# Altium schematic sheet NL_Sheet1.SchDoc
size A3
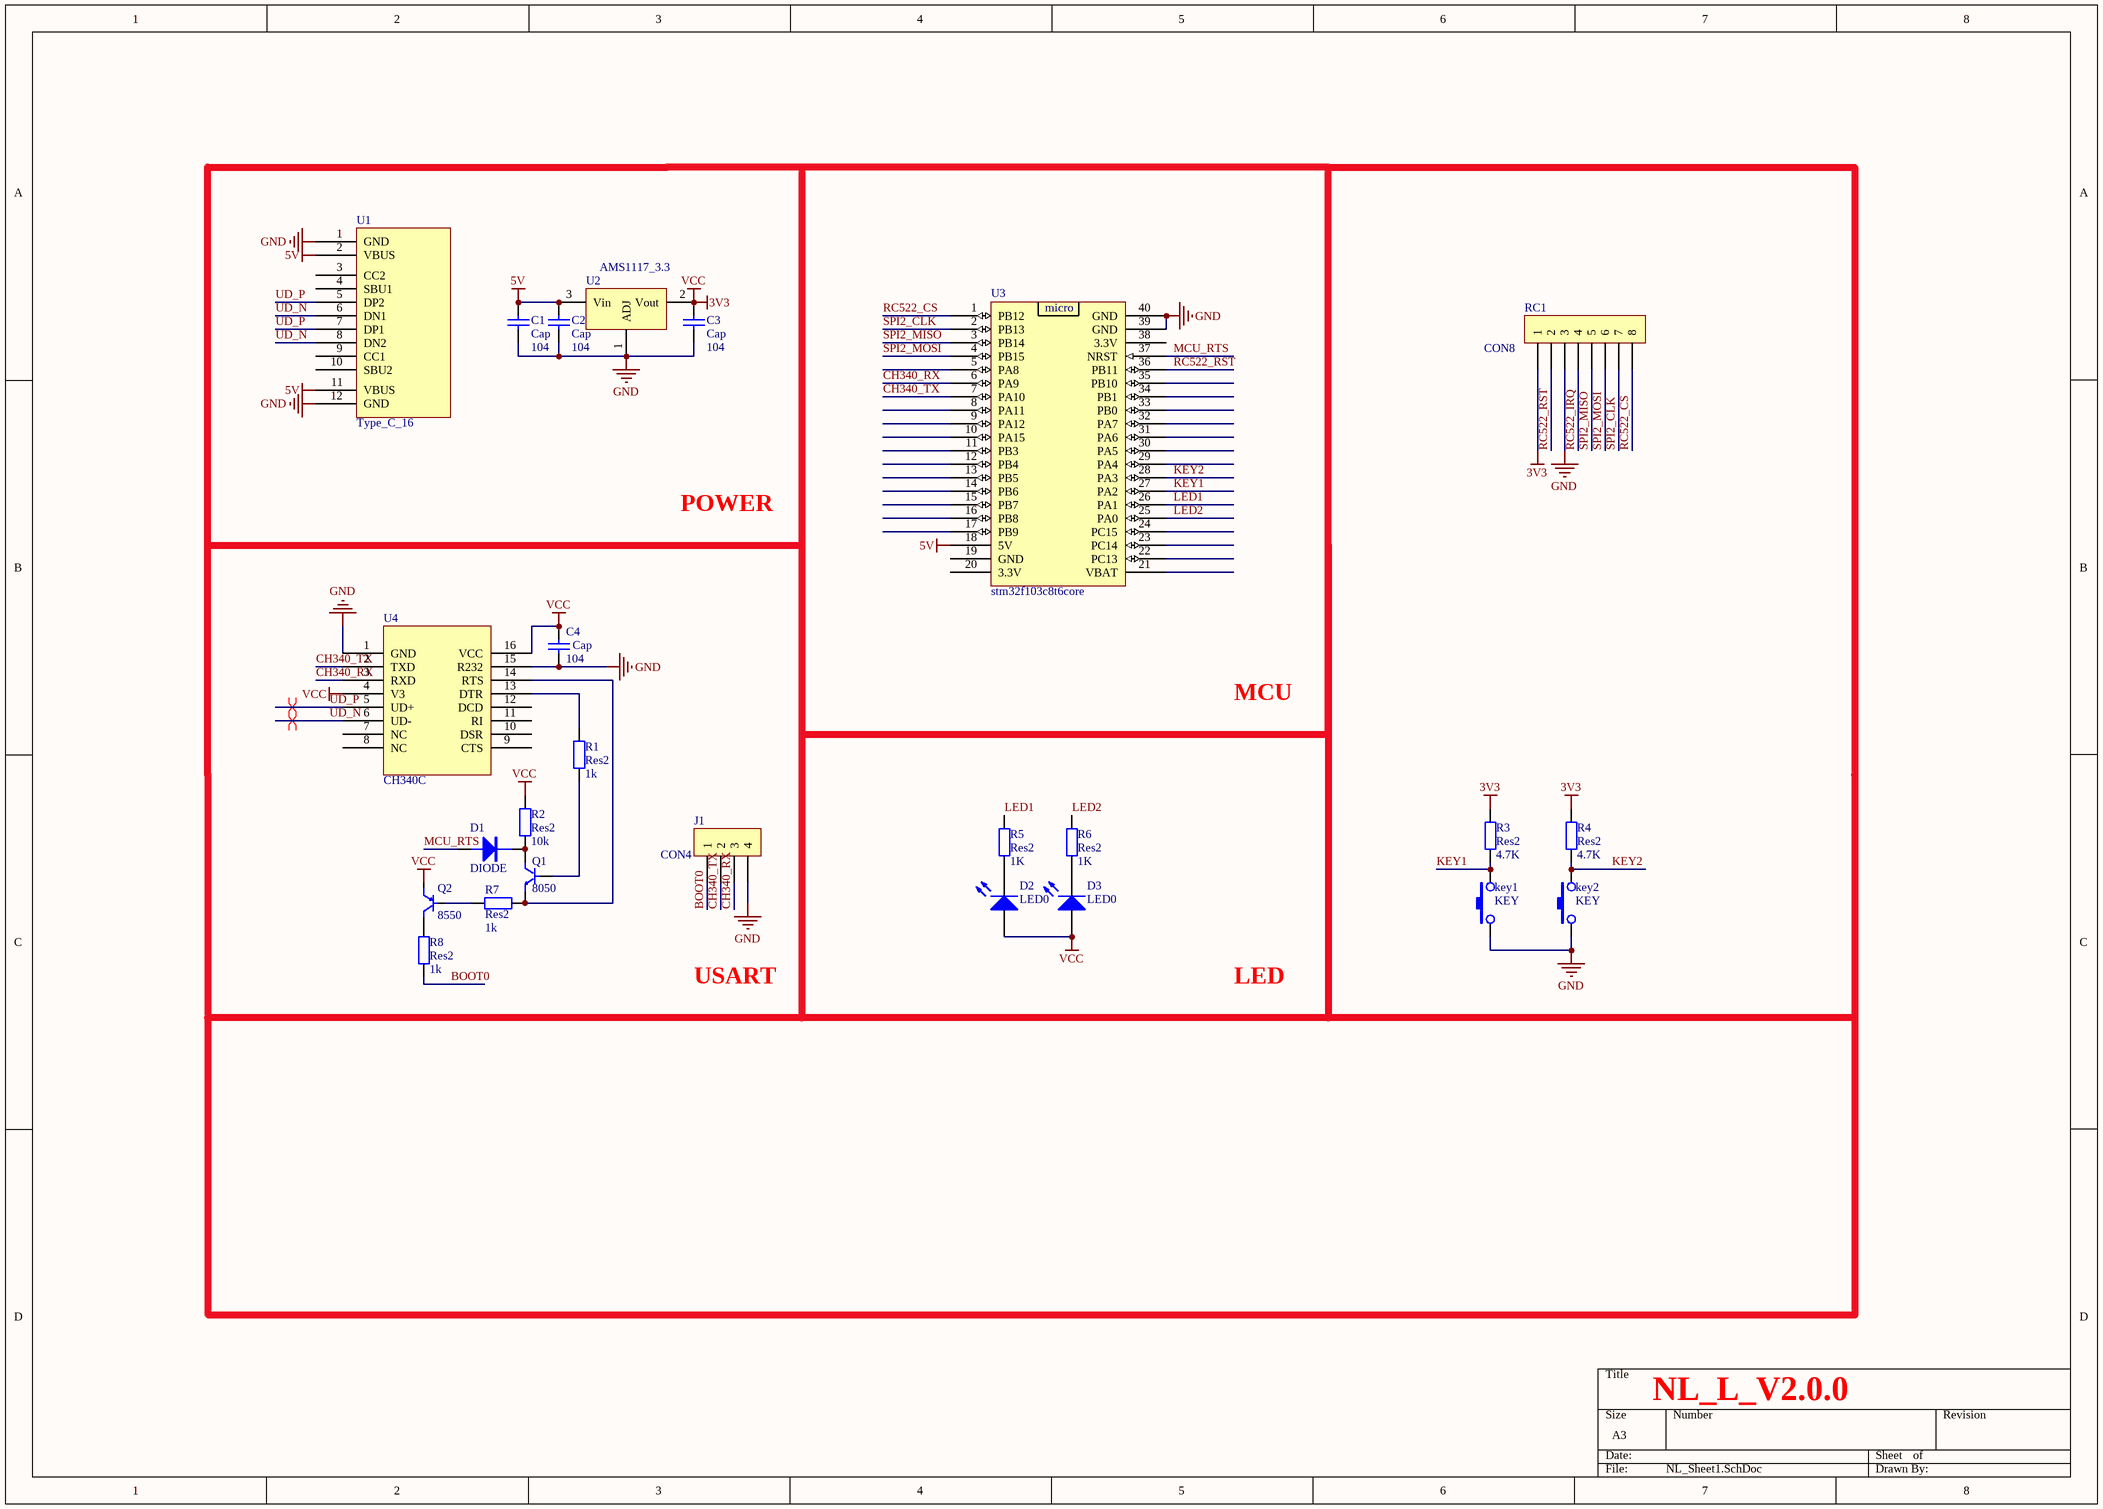
[diagram p0: NL_Sheet1.SchDoc]

## Parts
C1  Cap  value 104  [0805]
C2  Cap  value 104  [0805]
C3  Cap  value 104  [0805]
C4  Cap  value 104  [0805]
D1  DIODE  [0805L]
D2  LED0  [0805]
D3  LED0  [0805]
J1  CON4  [SIP4]
key1  KEY  [Key]
key2  KEY  [Key]
Q1  8050  [SOT23]
Q2  8550  [SOT23]
R1  Res2  value 1k  [0805]
R2  Res2  value 10k  [0805]
R3  Res2  value 4.7K  [0805]
R4  Res2  value 4.7K  [0805]
R5  Res2  value 1K  [0805]
R6  Res2  value 1K  [0805]
R7  Res2  value 1k  [0805]
R8  Res2  value 1k  [0805]
RC1  CON8  [RC522_SIP8]
U1  Type_C_16  [Type_C16]
U2  AMS1117_3.3  [SOT-223]
U3  stm32f103c8t6core  [stm32f103DIP40]
U4  CH340C  [SOP16]

## Nets
3V3: C3.2 C4.2 D2.1(A) D3.1(A) Q2.e R2.1 R3.1 R4.2 RC1.1 U2.2(Vout) U4.4(V3) U4.16(VCC)  [also labelled VCC]
5V: C1.2 C2.2 U1.2(VBUS) U1.11(VBUS) U2.3(Vin) U3.18(5V)
GND: C1.1 C2.1 C3.1 C4.1 J1.4 key1.1 key2.1 RC1.3 U1.1(GND) U1.12(GND) U2.1(ADJ) U3.39(GND) U3.40(GND) U4.1(GND) U4.15(R232)
BOOT0: J1.1 R8.1
CH340_RX: J1.3 U3.6(PA9) U4.3(RXD)
CH340_TX: J1.2 U3.7(PA10) U4.2(TXD)
KEY1: key1.2 R3.2 U3.27(PA2)
KEY2: key2.2 R4.1 U3.28(PA3)
LED1: R5.2 U3.26(PA1)
LED2: R6.2 U3.25(PA0)
MCU_RTS: D1.1 U3.37(NRST)
RC522_CS: RC1.8 U3.1(PB12)
RC522_IRQ: RC1.4
RC522_RST: RC1.2 U3.36(PB11)
SPI2_CLK: RC1.7 U3.2(PB13)
SPI2_MISO: RC1.5 U3.3(PB14)
SPI2_MOSI: RC1.6 U3.4(PB15)
UD_N: U1.6(DN1) U1.8(DN2) U4.6(UD-)
UD_P: U1.5(DP2) U1.7(DP1) U4.5(UD+)
NetD1_2: D1.2 Q1.c R2.2
NetD2_2: D2.2(K) R5.1
NetD3_2: D3.2(K) R6.1
NetQ1_b: Q1.b R1.2
NetQ1_e: Q1.e R7.2 U4.14(RTS)
NetQ2_b: Q2.b R7.1
NetQ2_c: Q2.c R8.2
NetR1_1: R1.1 U4.13(DTR)

Not connected (* = marked no-connect by the designer): U1 3(CC2) 4(SBU1) 9(CC1) 10(SBU2); U3 5(PA8) 8(PA11) 9(PA12) 10(PA15) 11(PB3) 12(PB4) 13(PB5) 14(PB6) 15(PB7) 16(PB8) 17(PB9) 19(GND) 20(3.3V) 21(VBAT) 22(PC13) 23(PC14) 24(PC15) 29(PA4) 30(PA5) 31(PA6) 32(PA7) 33(PB0) 34(PB1) 35(PB10) 38(3.3V); U4 7(NC) 8(NC) 9(CTS) 10(DSR) 11(RI) 12(DCD)

## Layout directives
differential pair: UD_N, UD_P

## Notes on the sheet
- POWER
- MCU
- USART
- LED
- NL_L_V2.0.0
- (in symbol stm32f103c8t6core) micro

## Library data of the parts
C1-C4 = Cap: Capacitor; Published: 8-Jun-2000; LatestRevisionDate: 17-Jul-2002; LatestRevisionNote: Re-released for DXP Platform.; PackageReference: RAD-0.3; Publisher: Altium Limited; PackageDescription: Radial Cap, Thru-Hole; 2 Leads; 0.3 in Pin Spacing
D2 D3 = LED0: Typical INFRARED GaAs LED; Published: 8-Jun-2000; LatestRevisionDate: 08-Jul-2005; LatestRevisionNote: Mech Layer 1 removed.; PackageReference: LED-0; Publisher: Altium Limited; PackageDescription: LED; 2 Leads
Q1 = NPN
Q2 = PNP
R1-R8 = Res2: Resistor; Published: 8-Jun-2000; LatestRevisionDate: 17-Jul-2002; LatestRevisionNote: Re-released for DXP Platform.; PackageReference: AXIAL-0.4; Publisher: Altium Limited; PackageDescription: Axial Device, Thru-Hole; 2 Leads; 0.4 in Pin Spacing
U2 = LM317: 3-Terminal Adjustable Positive Voltage Regulator